# Altium schematic sheet Spartan6-IO01.SchDoc
size A
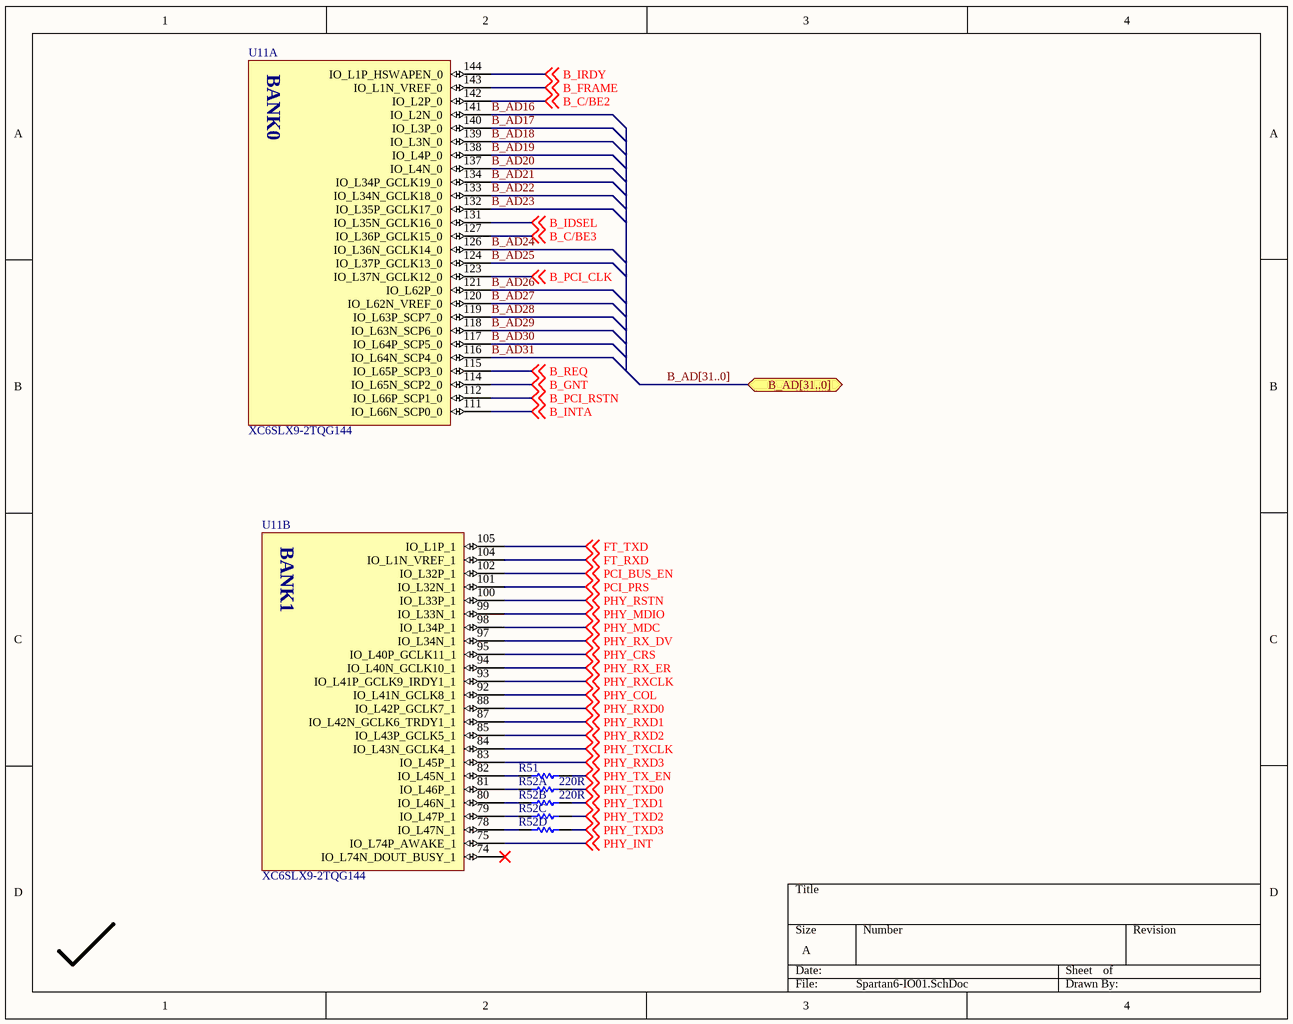
[diagram p0: Spartan6-IO01.SchDoc]

## Parts
R51  value 220R  [0603PKG]  (hidden comment: Res Semi)
R52  value 220R  [ARA4x0603]  (hidden comment: ChipArray_4x)  (parts A,B,C,D of 4)
U11  XC6SLX9-2TQG144  [TQG144]  (parts A,B of 7)

## Ports
B_AD[31..0]

## Nets
B_AD16: U11.141(IO_L2N_0)
B_AD17: U11.140(IO_L3P_0)
B_AD18: U11.139(IO_L3N_0)
B_AD19: U11.138(IO_L4P_0)
B_AD20: U11.137(IO_L4N_0)
B_AD21: U11.134(IO_L34P_GCLK19_0)
B_AD22: U11.133(IO_L34N_GCLK18_0)
B_AD23: U11.132(IO_L35P_GCLK17_0)
B_AD24: U11.126(IO_L36N_GCLK14_0)
B_AD25: U11.124(IO_L37P_GCLK13_0)
B_AD26: U11.121(IO_L62P_0)
B_AD27: U11.120(IO_L62N_VREF_0)
B_AD28: U11.119(IO_L63P_SCP7_0)
B_AD29: U11.118(IO_L63N_SCP6_0)
B_AD30: U11.117(IO_L64P_SCP5_0)
B_AD31: U11.116(IO_L64N_SCP4_0)
B_C/BE2: U11.142(IO_L2P_0) ; off-sheet B_C/BE2
B_C/BE3: U11.127(IO_L36P_GCLK15_0) ; off-sheet B_C/BE3
B_FRAME: U11.143(IO_L1N_VREF_0) ; off-sheet B_FRAME
B_GNT: U11.114(IO_L65N_SCP2_0) ; off-sheet B_GNT
B_IDSEL: U11.131(IO_L35N_GCLK16_0) ; off-sheet B_IDSEL
B_INTA: U11.111(IO_L66N_SCP0_0) ; off-sheet B_INTA
B_IRDY: U11.144(IO_L1P_HSWAPEN_0) ; off-sheet B_IRDY
B_PCI_CLK: U11.123(IO_L37N_GCLK12_0) ; off-sheet B_PCI_CLK
B_PCI_RSTN: U11.112(IO_L66P_SCP1_0) ; off-sheet B_PCI_RSTN
B_REQ: U11.115(IO_L65P_SCP3_0) ; off-sheet B_REQ
FT_RXD: U11.104(IO_L1N_VREF_1) ; off-sheet FT_RXD
FT_TXD: U11.105(IO_L1P_1) ; off-sheet FT_TXD
PCI_BUS_EN: U11.102(IO_L32P_1) ; off-sheet PCI_BUS_EN
PCI_PRS: U11.101(IO_L32N_1) ; off-sheet PCI_PRS
PHY_COL: U11.92(IO_L41N_GCLK8_1) ; off-sheet PHY_COL
PHY_CRS: U11.95(IO_L40P_GCLK11_1) ; off-sheet PHY_CRS
PHY_INT: U11.75(IO_L74P_AWAKE_1) ; off-sheet PHY_INT
PHY_MDC: U11.98(IO_L34P_1) ; off-sheet PHY_MDC
PHY_MDIO: U11.99(IO_L33N_1) ; off-sheet PHY_MDIO
PHY_RSTN: U11.100(IO_L33P_1) ; off-sheet PHY_RSTN
PHY_RX_DV: U11.97(IO_L34N_1) ; off-sheet PHY_RX_DV
PHY_RX_ER: U11.94(IO_L40N_GCLK10_1) ; off-sheet PHY_RX_ER
PHY_RXCLK: U11.93(IO_L41P_GCLK9_IRDY1_1) ; off-sheet PHY_RXCLK
PHY_RXD0: U11.88(IO_L42P_GCLK7_1) ; off-sheet PHY_RXD0
PHY_RXD1: U11.87(IO_L42N_GCLK6_TRDY1_1) ; off-sheet PHY_RXD1
PHY_RXD2: U11.85(IO_L43P_GCLK5_1) ; off-sheet PHY_RXD2
PHY_RXD3: U11.83(IO_L45P_1) ; off-sheet PHY_RXD3
PHY_TX_EN: R51.2 ; off-sheet PHY_TX_EN
PHY_TXCLK: U11.84(IO_L43N_GCLK4_1) ; off-sheet PHY_TXCLK
PHY_TXD0: R52.8(R1) ; off-sheet PHY_TXD0
PHY_TXD1: R52.7(R2) ; off-sheet PHY_TXD1
PHY_TXD2: R52.6(R3) ; off-sheet PHY_TXD2
PHY_TXD3: R52.5(R4) ; off-sheet PHY_TXD3
NetR51_1: R51.1 U11.82(IO_L45N_1)
NetR52_1: R52.1(R1) U11.81(IO_L46P_1)
NetR52_2: R52.2(R2) U11.80(IO_L46N_1)
NetR52_3: R52.3(R3) U11.79(IO_L47P_1)
NetR52_4: R52.4(R4) U11.78(IO_L47N_1)

Not connected (* = marked no-connect by the designer): U11 74(IO_L74N_DOUT_BUSY_1)*

## Buses and harness runs
bus B_AD[31..0] = port B_AD[31..0]

## Notes on the sheet
- (in symbol XC6SLX9-2TQG144C, part A) BANK0
- (in symbol XC6SLX9-2TQG144C, part B) BANK1

## Library data of the parts
R51 = Res Semi: Semiconductor Resistor; Published: 8-Jun-2000; LatestRevisionDate: 17-Jul-2002; LatestRevisionNote: Re-released for DXP Platform.; PackageReference: AXIAL-0.5; Publisher: Altium Limited; PackageDescription: Axial Device, Thru-Hole; 2 Leads; 0.5 in Pin Spacing
U11 = XC6SLX9-2TQG144C: Xilinx Spartan6 LX9